# EAGLE design zerofat (EAGLE 7.2.0)
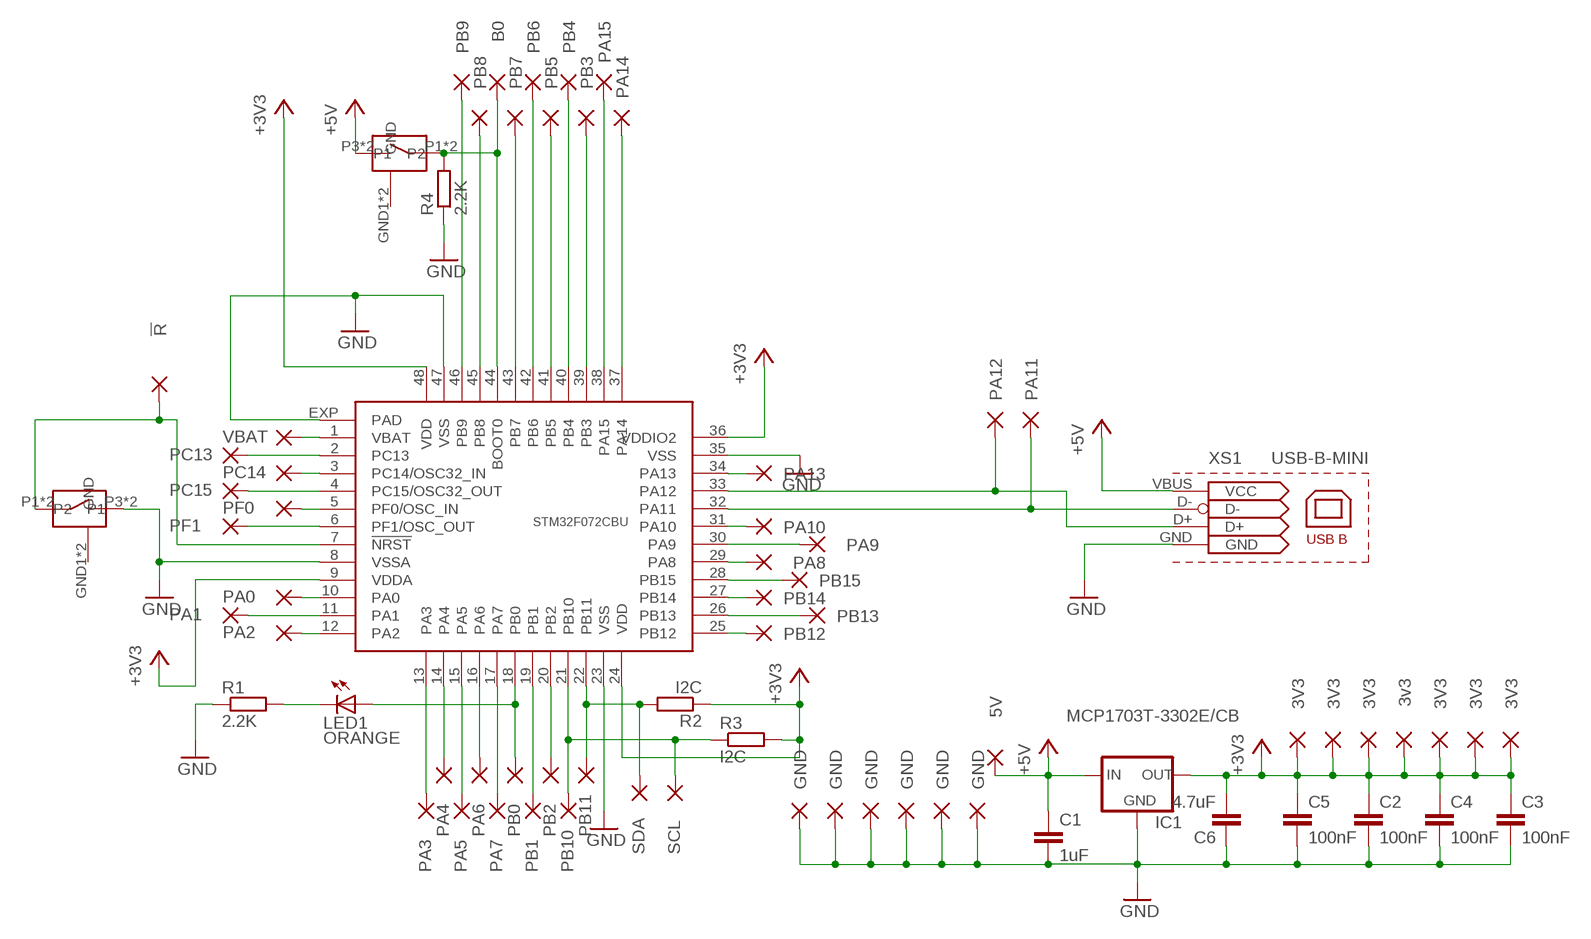
[diagram p0: schematic, sheet 1]

## Parts
B  EVQPT5A15  [EVQPT5A15]
C1  1uF  C-EUC0603K  [C0603K]
C2  100nF  C-EUC0603K  [C0603K]
C3  100nF  C-EUC0603K  [C0603K]
C4  100nF  C-EUC0603K  [C0603K]
C5  100nF  C-EUC0603K  [C0603K]
C6  4.7uF  C-EUC0603K  [C0603K]
IC1  MCP1703T-3302E/CB  XC63FPM  [SOT23]
LED1  ORANGE  LEDCHIP-LED0603  [CHIP-LED0603]
PAD1  VBAT  SMD2  [PAD_MINIMAL]
PAD2  PC13  SMD2  [PAD_MINIMAL]
PAD3  PC14  SMD2  [PAD_MINIMAL]
PAD4  PC15  SMD2  [PAD_MINIMAL]
PAD5  PF0  SMD2  [PAD_MINIMAL]
PAD6  !R  SMD2  [PAD_MINIMAL]
PAD7  PF1  SMD2  [PAD_MINIMAL]
PAD8  PA0  SMD2  [PAD_MINIMAL]
PAD9  PA2  SMD2  [PAD_MINIMAL]
PAD10  PA1  SMD2  [PAD_MINIMAL]
PAD11  PA3  SMD2  [PAD_MINIMAL]
PAD12  PA5  SMD2  [PAD_MINIMAL]
PAD13  PA7  SMD2  [PAD_MINIMAL]
PAD14  PB1  SMD2  [PAD_MINIMAL]
PAD15  PB10  SMD2  [PAD_MINIMAL]
PAD16  PA4  SMD2  [PAD_MINIMAL]
PAD17  PA6  SMD2  [PAD_MINIMAL]
PAD18  PB0  SMD2  [PAD_MINIMAL]
PAD19  PB2  SMD2  [PAD_MINIMAL]
PAD20  PB11  SMD2  [PAD_MINIMAL]
PAD21  PB12  SMD2  [PAD_MINIMAL]
PAD22  PB13  SMD2  [PAD_MINIMAL]
PAD23  PB14  SMD2  [PAD_MINIMAL]
PAD24  PA8  SMD2  [PAD_MINIMAL]
PAD25  PA9  SMD2  [PAD_MINIMAL]
PAD26  PA10  SMD2  [PAD_MINIMAL]
PAD27  PA13  SMD2  [PAD_MINIMAL]
PAD28  PB15  SMD2  [PAD_MINIMAL]
PAD29  PA12  SMD2  [PAD_MINIMAL]
PAD30  PA11  SMD2  [PAD_MINIMAL]
PAD31  PA14  SMD2  [PAD_MINIMAL]
PAD32  PB3  SMD2  [PAD_MINIMAL]
PAD33  PB5  SMD2  [PAD_MINIMAL]
PAD34  PB7  SMD2  [PAD_MINIMAL]
PAD35  B0  SMD2  [PAD_MINIMAL]
PAD36  PB6  SMD2  [PAD_MINIMAL]
PAD37  PB4  SMD2  [PAD_MINIMAL]
PAD38  PA15  SMD2  [PAD_MINIMAL]
PAD39  GND  SMD2  [PAD_MINIMAL]
PAD40  PB8  SMD2  [PAD_MINIMAL]
PAD41  PB9  SMD2  [PAD_MINIMAL]
PAD42  3V3  SMD2  [PAD_MINIMAL]
PAD43  3v3  SMD2  [PAD_MINIMAL]
PAD44  3V3  SMD2  [PAD_MINIMAL]
PAD45  5V  SMD2  [PAD_MINIMAL]
PAD46  GND  SMD2  [PAD_MINIMAL]
PAD47  GND  SMD2  [PAD_MINIMAL]
PAD48  3V3  SMD2  [PAD_MINIMAL]
PAD49  GND  SMD2  [PAD_MINIMAL]
PAD50  GND  SMD2  [PAD_MINIMAL]
PAD51  GND  SMD2  [PAD_MINIMAL]
PAD52  3V3  SMD2  [PAD_MINIMAL]
PAD53  3V3  SMD2  [PAD_MINIMAL]
PAD54  3V3  SMD2  [PAD_MINIMAL]
PAD55  SDA  SMD2  [PAD_MINIMAL]
PAD56  SCL  SMD2  [PAD_MINIMAL]
R  EVQPT5A15  [EVQPT5A15]
R1  2.2K  R-EU_R0603  [R0603]
R2  I2C  R-EU_R0603  [R0603]
R3  I2C  R-EU_R0603  [R0603]
R4  2.2K  R-EU_R0603  [R0603]
STM32F072CBU  STM32F072CBU  [UFQFPN48]
XS1  USB-B-MINI  [USB-MINIB]

## Nets
+3V3: C2.1 C3.1 C4.1 C5.1 C6.2 IC1.2(OUT) PAD42.1(P) PAD43.1(P) PAD44.1(P) PAD48.1(P) PAD52.1(P) PAD53.1(P) PAD54.1(P) R2.1 R3.2 STM32F072CBU.9(VDDA) STM32F072CBU.24(VDD) STM32F072CBU.36(VDDIO2) STM32F072CBU.48(VDD)
+5V: B.P3(P2) B.P4(P2) C1.1 IC1.3(IN) PAD45.1(P) XS1.VBUS(VCC)
GND: C1.2 C2.2 C3.2 C4.2 C5.2 C6.1 IC1.1(GND) PAD39.1(P) PAD46.1(P) PAD47.1(P) PAD49.1(P) PAD50.1(P) PAD51.1(P) R1.1 R4.1 R.P3(P2) R.P4(P2) STM32F072CBU.8(VSSA) STM32F072CBU.23(VSS) STM32F072CBU.35(VSS) STM32F072CBU.47(VSS) STM32F072CBU.EXP(PAD) XS1.GND
N$1: PAD29.1(P) STM32F072CBU.33(PA12) XS1.D+
N$2: LED1.C R1.2
N$3: PAD6.1(P) R.P1 R.P2(P1) STM32F072CBU.7(!NRST)
N$4: PAD30.1(P) STM32F072CBU.32(PA11) XS1.D-
N$5: PAD2.1(P) STM32F072CBU.2(PC13)
N$6: PAD3.1(P) STM32F072CBU.3(PC14/OSC32_IN)
N$7: PAD5.1(P) STM32F072CBU.5(PF0/OSC_IN)
N$8: B.P1 B.P2(P1) PAD35.1(P) R4.2 STM32F072CBU.44(BOOT0)
N$9: PAD7.1(P) STM32F072CBU.6(PF1/OSC_OUT)
N$10: PAD4.1(P) STM32F072CBU.4(PC15/OSC32_OUT)
N$11: PAD8.1(P) STM32F072CBU.10(PA0)
N$12: PAD9.1(P) STM32F072CBU.12(PA2)
N$13: PAD10.1(P) STM32F072CBU.11(PA1)
N$14: PAD11.1(P) STM32F072CBU.13(PA3)
N$15: PAD16.1(P) STM32F072CBU.14(PA4)
N$16: PAD12.1(P) STM32F072CBU.15(PA5)
N$17: PAD17.1(P) STM32F072CBU.16(PA6)
N$18: PAD13.1(P) STM32F072CBU.17(PA7)
N$19: LED1.A PAD18.1(P) STM32F072CBU.18(PB0)
N$20: PAD14.1(P) STM32F072CBU.19(PB1)
N$21: PAD19.1(P) STM32F072CBU.20(PB2)
N$22: PAD15.1(P) PAD56.1(P) R3.1 STM32F072CBU.21(PB10)
N$23: PAD20.1(P) PAD55.1(P) R2.2 STM32F072CBU.22(PB11)
N$24: PAD21.1(P) STM32F072CBU.25(PB12)
N$25: PAD22.1(P) STM32F072CBU.26(PB13)
N$26: PAD23.1(P) STM32F072CBU.27(PB14)
N$27: PAD24.1(P) STM32F072CBU.29(PA8)
N$28: PAD25.1(P) STM32F072CBU.30(PA9)
N$29: PAD26.1(P) STM32F072CBU.31(PA10)
N$30: PAD31.1(P) STM32F072CBU.37(PA14)
N$31: PAD38.1(P) STM32F072CBU.38(PA15)
N$32: PAD32.1(P) STM32F072CBU.39(PB3)
N$33: PAD37.1(P) STM32F072CBU.40(PB4)
N$34: PAD33.1(P) STM32F072CBU.41(PB5)
N$35: PAD36.1(P) STM32F072CBU.42(PB6)
N$36: PAD34.1(P) STM32F072CBU.43(PB7)
N$37: PAD40.1(P) STM32F072CBU.45(PB8)
N$38: PAD41.1(P) STM32F072CBU.46(PB9)
N$39: PAD27.1(P) STM32F072CBU.34(PA13)
N$40: PAD28.1(P) STM32F072CBU.28(PB15)
VBAT: PAD1.1(P) STM32F072CBU.1(VBAT)
Unconnected: B.GND1(GND) B.GND2(GND) R.GND1(GND) R.GND2(GND) XS1.MTN1(S1) XS1.MTN2(S1) XS1.MTN3(S2) XS1.MTN4(S2)

## Library data of the parts
B R = zerofat:EVQPT5A15: Panasonic EVQPT5A15 4.9 mm Square SMD Light Touch Switch
C1-C6 = rcl:C-EU: CAPACITOR, European symbol
IC1 = v-reg:XC63FP: Positiv Voltage Regulators www.torex.co.jp/english/product/pro02/pdf/0201_xc62fp.pdf
LED1 = led:LED: LED OSRAM: - CHIPLED LG R971, LG N971, LY N971, LG Q971, LY Q971, LO R971, LY R971 LH N974, LH R974 LS Q976, LO Q976, LY Q976 LO Q996 - Hyper CHIPLED LW Q18S LB Q993, LB Q99A, LB R99A - SideLED LS A670, LO A670, LY A670, LG A670, LP A670 LB A673, LV A673, LT A673, LW A673 LH A674 LY A675 LS A676, LA A676, LO A676, LY A676, LW A676 LS A679, LY A679, LG A679 - Hyper Micro SIDELED® LS Y876, LA Y876, LO Y876, LY Y876 LT Y87S - SmartLED LW L88C, LW L88S LB L89C, LB L89S, LG L890 LS L89K, LO L89K, LY L89K LS L896, LA L896, LO L896, LY L896 - TOPLED LS T670, LO T670, LY T670, LG T670, LP T670 LSG T670, LSP T670, LSY T670, LOP T670, LYG T670 LG T671, LOG T671, LSG T671 LB T673, LV T673, LT T673, LW T673 LH T674 LS T676, LA T676, LO T676, LY T676, LB T676, LH T676, LSB T676, LW T676 LB T67C, LV T67C, LT T67C, LS T67K, LO T67K, LY T67K, LW E67C LS E67B, LA E67B, LO E67B, LY E67B, LB E67C, LV E67C, LT E67C LW T67C LS T679, LY T679, LG T679 LS T770, LO T770, LY T770, LG T770, LP T770 LB T773, LV T773, LT T773, LW T773 LH T774 LS E675, LA E675, LY E675, LS T675 LS T776, LA T776, LO T776, LY T776, LB T776 LHGB T686 LT T68C, LB T68C - Hyper Mini TOPLED® LB M676 - Mini TOPLED Santana® LG M470 LS M47K, LO M47K, LY M47K Source: http://www.osram.convergy.de LUXEON: - LUMILED® LXK2-PW12-R00, LXK2-PW12-S00, LXK2-PW14-U00, LXK2-PW14-V00 LXK2-PM12-R00, LXK2-PM12-S00, LXK2-PM14-U00 LXK2-PE12-Q00, LXK2-PE12-R00, LXK2-PE12-S00, LXK2-PE14-T00, LXK2-PE14-U00 LXK2-PB12-K00, LXK2-PB12-L00, LXK2-PB12-M00, LXK2-PB14-N00, LXK2-PB14-P00, LXK2-PB14-Q00 LXK2-PR12-L00, LXK2-PR12-M00, LXK2-PR14-Q00, LXK2-PR14-R00 LXK2-PD12-Q00, LXK2-PD12-R00, LXK2-PD12-S00 LXK2-PH12-R00, LXK2-PH12-S00 LXK2-PL12-P00, LXK2-PL12-Q00, LXK2-PL12-R00 Source: www.luxeon.com KINGBRIGHT: KA-3528ASYC Source: www.kingbright.com
PAD1-PAD56 = zerofat:SMD2: SMD PAD
R1-R4 = rcl:R-EU_: RESISTOR, European symbol
STM32F072CBU = zerofat:STM32F072CBU: Core: ARM®32-bit Cortex®-M0 CPU, frequency up to 48 MHz 16 Kb SRAM, 128 Kbytes Flash VDD= 2.0 V to 3.6 V Programmable voltage detector (PVD) RTC with calibration 7-channel DMA controller 12-bit, 1.0 μs ADC (up to 16 channels) 12-bit DAC (2 channels) 12 timers 2*I2C, 4*USARTs, 2*SPIs (18 Mbit/s) crystallless USB 2.0 with BCD and LPM support
XS1 = f-connector-interface:USB-B: BERG USB connector

## Board
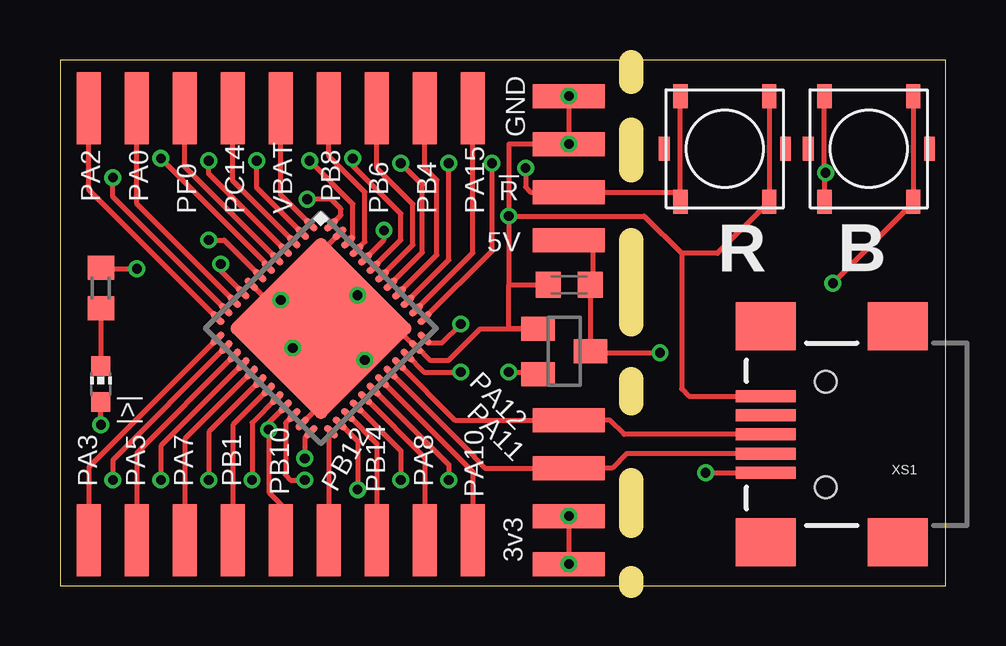
[diagram p1: board, top side]
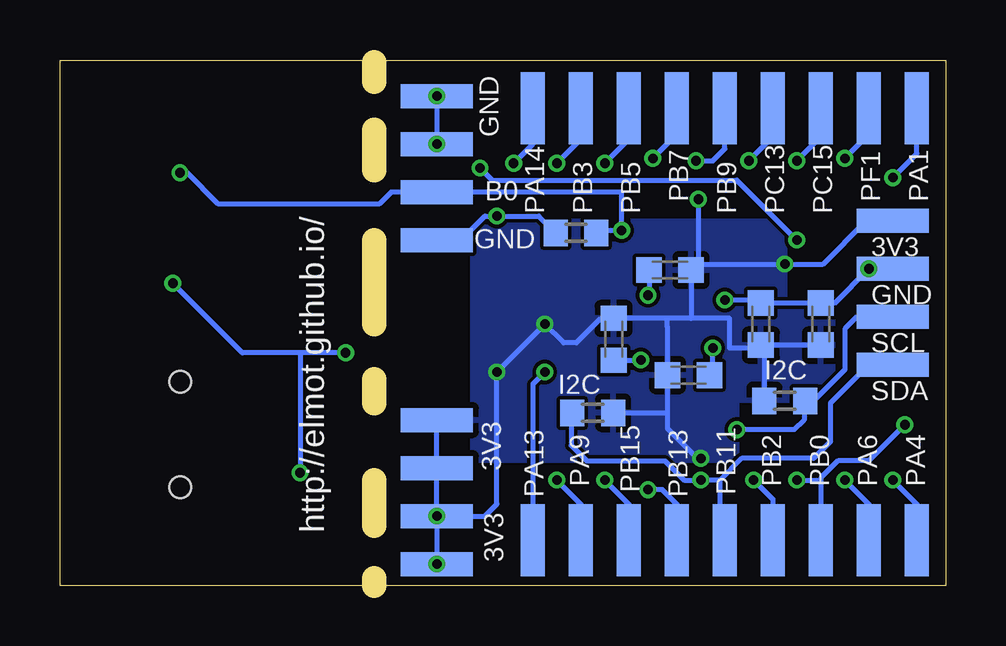
[diagram p2: board, bottom side, seen from below]

Size 36.9 x 21.9 mm. Coordinates in mm from the lower left corner, seen from the top.
Outline: 23.8,0 0,0 0,21.9 36.9,21.9 36.9,0 23.8,0
Outline: 23.8,2.5 23.8,4.4
Outline: 23.8,10.9 23.8,14.4
Outline: 23.8,17.3 23.8,19
Outline: 23.8,0.3 23.8,0
Outline: 23.8,21.8 23.8,21
Outline: 23.8,7.6 23.8,8.6
Copper layers (1*16): Top 0.035mm / dielectric 1.5mm / Bottom 0.035mm
Design rules "SeeedStudio_2layer_DRU_no_angle_20140221 *": minimum track width 6mil, minimum drill 12mil, track to track 6mil, track to pad 6mil, pad to pad 6mil, via to via 6mil, smd to smd 0mil, copper to edge 10mil, drill to drill 10mil, minimum pad ring 10mil, minimum via ring 6mil, stop-mask expansion 2mil, vias tented up to drill 100mil, thermal gap 10mil

### Footprints (pad centres in the part's own frame; a part is rotated, then mirrored left to right if it is on the bottom)
EVQPT5A15 = smd 0.45 x 1: GND1 -2.525,0; GND2 2.525,0 | smd 0.6 x 1: P1 -1.85,-2.2; P2 -1.85,2.2; P3 1.85,2.2; P4 1.85,-2.2
C0603K = smd 1.05 x 1.08: 1 -0.875,0; 2 0.875,0
SOT23 = smd 1 x 1.4: 1 -0.95,-1.1; 2 0.95,-1.1; 3 0,1.1
CHIP-LED0603 = smd 0.8 x 0.8: A 0,-0.75; C 0,0.75
PAD_MINIMAL = smd 1 x 3: 1 0,0
R0603 = smd 1 x 1.1: 1 -0.85,0; 2 0.85,0
UFQFPN48 = smd 0.7 x 0.3: 1 -3.35,2.75; 2 -3.35,2.25; 3 -3.35,1.75; 4 -3.35,1.25; 5 -3.35,0.75; 6 -3.35,0.25; 7 -3.35,-0.25; 8 -3.35,-0.75; 9 -3.35,-1.25; 10 -3.35,-1.75; 11 -3.35,-2.25; 12 -3.35,-2.75; 25 3.35,-2.75; 26 3.35,-2.25; 27 3.35,-1.75; 28 3.35,-1.25; 29 3.35,-0.75; 30 3.35,-0.25; 31 3.35,0.25; 32 3.35,0.75; 33 3.35,1.25; 34 3.35,1.75; 35 3.35,2.25; 36 3.35,2.75 | smd 0.3 x 0.7: 13 -2.75,-3.35; 14 -2.25,-3.35; 15 -1.75,-3.35; 16 -1.25,-3.35; 17 -0.75,-3.35; 18 -0.25,-3.35; 19 0.25,-3.35; 20 0.75,-3.35; 21 1.25,-3.35; 22 1.75,-3.35; 23 2.25,-3.35; 24 2.75,-3.35; 37 2.75,3.35; 38 2.25,3.35; 39 1.75,3.35; 40 1.25,3.35; 41 0.75,3.35; 42 0.25,3.35; 43 -0.25,3.35; 44 -0.75,3.35; 45 -1.25,3.35; 46 -1.75,3.35; 47 -2.25,3.35; 48 -2.75,3.35 | smd 5.5 x 5.5: EXP 0,0
USB-MINIB = smd 2.5 x 0.5: D+ 2.5,0; D- 2.5,0.8; GND 2.5,-1.6; ID 2.5,-0.8; VBUS 2.5,1.6 | smd 2.5 x 2: MTN1 -3,4.5; MTN2 2.5,4.5; MTN3 -3,-4.5; MTN4 2.5,-4.5 | hole 0.9: 0,2.2; 0,-2.2

### Placement (x,y rotation side)
B  33.7,18.2 0 top
C1  21.22,12.53 180 top
C2  11.48,13.15 180 bottom
C3  10.71,8.77 0 bottom
C4  13.83,10.26 270 bottom
C5  7.7,10.9 90 bottom
C6  5.2,10.9 270 bottom
IC1  21.01,9.76 270 top
LED1  1.7,8.4 0 top
PAD1  9.2,19.9 0 top
PAD2  7.2,19.9 0 bottom
PAD3  7.2,19.9 0 top
PAD4  5.2,19.9 0 bottom
PAD5  5.2,19.9 0 top
PAD6  21.2,16.4 90 top
PAD7  3.2,19.9 0 bottom
PAD8  3.2,19.9 0 top
PAD9  1.2,19.9 0 top
PAD10  1.2,19.9 0 bottom
PAD11  1.2,1.9 180 top
PAD12  3.2,1.9 180 top
PAD13  5.2,1.9 180 top
PAD14  7.2,1.9 180 top
PAD15  9.2,1.9 180 top
PAD16  1.2,1.9 180 bottom
PAD17  3.2,1.9 180 bottom
PAD18  5.2,1.9 180 bottom
PAD19  7.2,1.9 180 bottom
PAD20  9.2,1.9 180 bottom
PAD21  11.2,1.9 180 top
PAD22  11.2,1.9 180 bottom
PAD23  13.2,1.9 180 top
PAD24  15.2,1.9 180 top
PAD25  15.2,1.9 180 bottom
PAD26  17.2,1.9 180 top
PAD27  17.2,1.9 180 bottom
PAD28  13.2,1.9 180 bottom
PAD29  21.2,6.9 270 top
PAD30  21.2,4.9 270 top
PAD31  17.2,19.9 0 bottom
PAD32  15.2,19.9 0 bottom
PAD33  13.2,19.9 0 bottom
PAD34  11.2,19.9 0 bottom
PAD35  21.2,16.4 90 bottom
PAD36  13.2,19.9 0 top
PAD37  15.2,19.9 0 top
PAD38  17.2,19.9 0 top
PAD39  21.2,18.4 270 top
PAD40  11.2,19.9 0 top
PAD41  9.2,19.9 0 bottom
PAD42  21.2,0.9 90 bottom
PAD43  21.2,2.9 270 top
PAD44  21.2,0.9 270 top
PAD45  21.2,14.4 270 top
PAD46  21.2,20.4 90 bottom
PAD47  21.2,20.4 270 top
PAD48  21.2,2.9 90 bottom
PAD49  21.2,18.4 90 bottom
PAD50  21.2,14.4 90 bottom
PAD51  2.2,13.2 270 bottom
PAD52  21.2,6.9 270 bottom
PAD53  21.2,4.9 90 bottom
PAD54  2.2,15.2 270 bottom
PAD55  2.2,9.2 270 bottom
PAD56  2.2,11.2 270 bottom
R  27.7,18.2 0 top
R1  1.7,12.4 270 top
R2  14.7,7.2 180 bottom
R3  6.7,7.7 180 bottom
R4  15.4,14.7 0 bottom
STM32F072CBU  10.87,10.72 315 top
XS1  31.9,6.3 180 top

### Tracks (layer width: path | path; a pad name or v marks a point on that pad's centre or on a via)
+3V3  (via drill 0.4)
  Top 0.2: STM32F072CBU.9 6.7,13.12 v6.7,13.4 | STM32F072CBU.24 10.2,6.16 v10.2,5.3 | PAD48.1 PAD44.1 | v18.7,8.9 19.82,8.9 IC1.2 | STM32F072CBU.36 15.37,10.11 15.91,10.11 v16.7,10.9 | 11.29,15.09 STM32F072CBU.48 11.7,15.44 11.7,15.7 11.3,16.1 v10.3,16.1
  Bottom 0.2: 11.6,11.13 11.6,10.8 11.58,10.79 C3.1 11.58,7.2 | 11.6,11.13 C4.1 14.36,11.13 15.39,10.11 15.91,10.11 v16.7,10.9 v18.7,8.9 18.7,3.4 19.2,2.9 PAD48.1 | C2.1 10.6,11.13 | 10.6,11.13 11.6,11.13 | 7.83,9.9 9,9.9 9,11.13 10.6,11.13 | C2.1 10.45,13.15 10.2,13.4 v6.7,13.4 5.1,13.4 3.3,15.2 PAD54.1 | 11.58,7.2 11.58,6.54 10.35,5.3 v10.2,5.3 | PAD48.1 PAD44.1 | 7.83,9.9 C5.1 C6.2 4.88,10.02 | R2.1 11.58,7.2 | PAD48.1 PAD53.1 PAD52.1 | 7.83,9.9 7.55,9.62 R3.2 | v10.3,16.1 10.3,13.15 C2.1
  other vias: 21.2,2.9 21.2,0.9
  pour Bottom: 19.7,15.2 6.7,15.2 6.7,11.7 4.7,11.7 4.7,7.7 8.7,7.7 8.7,5.2 19.7,5.2
+5V  (via drill 0.4)
  Top 0.2: PAD45.1 22.2,14.4 22.2,12.53 C1.1 22.09,9.76 | 22.09,9.76 IC1.3 | 22.09,9.76 22.15,9.7 v25,9.7 | v26.9,4.7 XS1.VBUS | B.P3 B.P4 35.55,15.95 v32.2,12.6
  Bottom 0.2: 26.9,9.7 v26.9,4.7 | v25,9.7 26.9,9.7 | 26.9,9.7 29.3,9.7 v32.2,12.6
GND  (via drill 0.4)
  Top 0.2: STM32F072CBU.23 10.7,7.37 10.7,7.4 9.7,8.4 v9.7,9.9 | STM32F072CBU.8 8.63,11.9 v9.2,11.9 11.7,9.4 v12.7,9.4 | v12.7,9.4 12.7,10.4 14.37,10.4 STM32F072CBU.35 14.86,9.94 15.4,9.4 16.2,9.4 17.5,10.7 IC1.1 18.7,10.71 18.7,12.53 | 12,12.1 v12.4,12.1 12.4,9.7 v12.7,9.4 | 12,12.1 10.95,13.15 | 10.95,13.15 10.7,13.4 | STM32F072CBU.47 10.95,13.98 10.95,13.15 | R1.1 1.85,13.4 2.05,13.2 v3.2,13.2 | PAD46.1 PAD49.1 18.7,18.4 v18.7,15.4 | v18.7,15.4 18.7,12.53 | 18.7,12.53 C1.2 | v18.7,15.4 24.34,15.4 25.9,13.84 | 25.9,13.84 25.9,8.2 26.2,7.9 XS1.GND | 12,12.1 12.2,11.9 12.2,9.9 v12.7,9.4 | R.P3 R.P4 27.39,13.84 25.9,13.84
  Bottom 0.2: C3.2 9.7,8.9 v9.7,9.9 | C4.2 arc90 13.81,9.4 v12.7,9.4 | C2.2 12.35,12.14 v12.4,12.1 | PAD46.1 PAD49.1 | C6.1 C5.2 7.83,11.9 v9.2,11.9 | PAD50.1 21,14.2 20.4,14.2 19.2,15.4 v18.7,15.4 16.95,15.4 R4.1 | 4.83,11.77 C6.1 | C6.1 4.62,11.77 v3.2,13.2 PAD51.1
  other vias: 21.2,20.4 21.2,18.4
  pour Top: 10.9,7.1 14.5,10.7 10.9,14.3 7.3,10.7
N$1
  Top 0.2: STM32F072CBU.33 16.46,6.9 PAD29.1 22.9,6.9 23.5,6.3 XS1.D+
N$2
  Top 0.2: R1.2 LED1.C
N$3  (via drill 0.4)
  Top 0.2: STM32F072CBU.7 6.84,14.4 v6.2,14.4 | 25.85,16.4 PAD6.1 19.6,16.4 19.4,16.6 v19.4,17.4 | 25.85,16.4 R.P2 | 25.85,16.4 R.P1
  Bottom 0.2: v6.2,14.4 8.7,16.9 18.9,16.9 v19.4,17.4
N$4
  Top 0.2: STM32F072CBU.32 17.25,5.4 17.25,5.35 17.7,4.9 PAD30.1 23,4.9 23.6,5.5 XS1.D-
N$5  (via drill 0.4)
  Top 0.2: STM32F072CBU.2 8.2,16.57 v8.2,17.7
  Bottom 0.2: v8.2,17.7 7.2,18.7 PAD2.1
N$6
  Top 0.2: STM32F072CBU.3 7.2,16.86 PAD3.1
N$7
  Top 0.2: STM32F072CBU.5 5.2,17.45 PAD5.1
N$8  (via drill 0.4)
  Top 0.2: STM32F072CBU.44 13.5,14.41 v13.5,14.8 | B.P1 31.85,17.15 v31.9,17.2 31.85,17.25 B.P2
  Bottom 0.2: v31.9,17.2 31.6,17.2 30.3,15.9 23.6,15.9 23.1,16.4 PAD35.1 13.5,16.4 v13.5,14.8 14.45,14.8 R4.2
N$9  (via drill 0.4)
  Top 0.2: STM32F072CBU.6 8.68,13.32 v4.2,17.8
  Bottom 0.2: v4.2,17.8 3.2,18.8 PAD7.1
N$10  (via drill 0.4)
  Top 0.2: STM32F072CBU.4 6.2,17.16 v6.2,17.7
  Bottom 0.2: v6.2,17.7 5.2,18.7 PAD4.1
N$11
  Top 0.2: STM32F072CBU.10 3.2,15.91 PAD8.1
N$12
  Top 0.2: STM32F072CBU.12 1.2,16.5 PAD9.1
N$13  (via drill 0.4)
  Top 0.2: STM32F072CBU.11 2.2,16.21 v2.2,17
  Bottom 0.2: v2.2,17 1.2,18 PAD10.1
N$14
  Top 0.2: STM32F072CBU.13 1.2,4.94 PAD11.1
N$15  (via drill 0.4)
  Top 0.2: STM32F072CBU.14 2.2,5.23 v2.2,4.4
  Bottom 0.2: v2.2,4.4 1.2,3.4 PAD16.1
N$16
  Top 0.2: STM32F072CBU.15 3.2,5.53 PAD12.1
N$17  (via drill 0.4)
  Top 0.2: STM32F072CBU.16 4.2,5.82 v4.2,4.4
  Bottom 0.2: v4.2,4.4 3.2,3.4 PAD17.1
N$18
  Top 0.2: STM32F072CBU.17 5.2,6.11 PAD13.1
N$19  (via drill 0.4)
  Top 0.2: STM32F072CBU.18 6.2,6.4 v6.2,4.4 | v1.7,6.7 LED1.A
  Bottom 0.2: 5.2,4.4 PAD18.1 | v6.2,4.4 5.2,4.4 | 5.2,4.4 5.2,4.49 4.49,5.2 3.2,5.2 v1.7,6.7
N$20
  Top 0.2: STM32F072CBU.19 7.2,6.7 PAD14.1
N$21  (via drill 0.4)
  Top 0.2: STM32F072CBU.20 8,6.79 v8,4.4
  Bottom 0.2: v8,4.4 7.2,3.6 PAD19.1
N$22  (via drill 0.4)
  Top 0.2: STM32F072CBU.21 8.7,6.78 v8.7,6.5 8.7,3.9 9.2,3.4 PAD15.1
  Bottom 0.2: v8.7,6.5 6.3,6.5 5.9,6.9 5.9,7.65 R3.1 5.5,7.7 4.2,9 4.2,10.7 3.7,11.2 PAD56.1
N$23  (via drill 0.4)
  Top 0.2: STM32F072CBU.22 9.4,6.78 9.4,4.6 9.6,4.4 v10.2,4.4
  Bottom 0.2: PAD20.1 9.4,2.1 9.4,4.4 | R2.2 15.6,7.15 15.6,5.84 14.96,5.2 11.7,5.2 10.9,4.4 v10.2,4.4 9.4,4.4 | PAD55.1 3.2,9.2 4.8,7.6 4.8,6 5.5,5.3 8.5,5.3 9.4,4.4
N$24
  Top 0.2: STM32F072CBU.25 11.2,6.31 PAD21.1
N$25  (via drill 0.4)
  Top 0.2: STM32F072CBU.26 12.4,6.01 v12.4,4
  Bottom 0.2: PAD22.1 11.2,3.4 11.8,4 v12.4,4
N$26
  Top 0.2: STM32F072CBU.27 13.2,5.92 PAD23.1
N$27
  Top 0.2: STM32F072CBU.29 15.2,5.33 PAD24.1
N$28  (via drill 0.4)
  Top 0.2: STM32F072CBU.30 16.2,5.04 v16.2,4.4
  Bottom 0.2: v16.2,4.4 15.2,3.4 PAD25.1
N$29
  Top 0.2: STM32F072CBU.31 17.2,4.74 PAD26.1
N$30  (via drill 0.4)
  Top 0.2: STM32F072CBU.37 18,13.96 v18,17.6
  Bottom 0.2: v18,17.6 17.2,18.4 PAD31.1
N$31
  Top 0.2: STM32F072CBU.38 17.2,13.87 PAD38.1
N$32  (via drill 0.4)
  Top 0.2: STM32F072CBU.39 16.2,13.57 v16.2,17.6
  Bottom 0.2: v16.2,17.6 15.2,18.6 PAD32.1
N$33
  Top 0.2: STM32F072CBU.40 15.7,13.78 15.7,16.9 15.2,17.4 PAD37.1
N$34  (via drill 0.4)
  Top 0.2: STM32F072CBU.41 15.1,13.89 15.1,16.7 v14.2,17.6
  Bottom 0.2: v14.2,17.6 13.2,18.6 PAD33.1
N$35
  Top 0.2: STM32F072CBU.42 14.7,14.2 14.7,15.9 13.2,17.4 PAD36.1
N$36  (via drill 0.4)
  Top 0.2: STM32F072CBU.43 14.2,14.4 14.2,15.5 12.2,17.5 v12.2,17.8
  Bottom 0.2: PAD34.1 11.2,18.8 v12.2,17.8
N$37
  Top 0.2: STM32F072CBU.45 12.7,14.32 12.7,16.4 11.2,17.9 PAD40.1
N$38  (via drill 0.4)
  Top 0.2: STM32F072CBU.46 12.2,14.52 12.2,15.9 v10.4,17.7
  Bottom 0.2: PAD41.1 9.2,18.2 9.7,17.7 v10.4,17.7
N$39  (via drill 0.4)
  Top 0.2: STM32F072CBU.34 15.16,8.9 v16.7,8.9
  Bottom 0.2: v16.7,8.9 17.2,8.4 PAD27.1
N$40  (via drill 0.4)
  Top 0.2: STM32F072CBU.28 14.2,5.62 v14.2,4.4
  Bottom 0.2: v14.2,4.4 13.2,3.4 PAD28.1
VBAT
  Top 0.2: STM32F072CBU.1 9.2,16.28 PAD1.1

### Text on the board
tNames: R | B | |>|
bNames: http://elmot.github.io/
bValues: 4x / 100nF
bStop: (c)elmot | ZeroFat32